# EAGLE design nexys2proto (EAGLE 5.06)
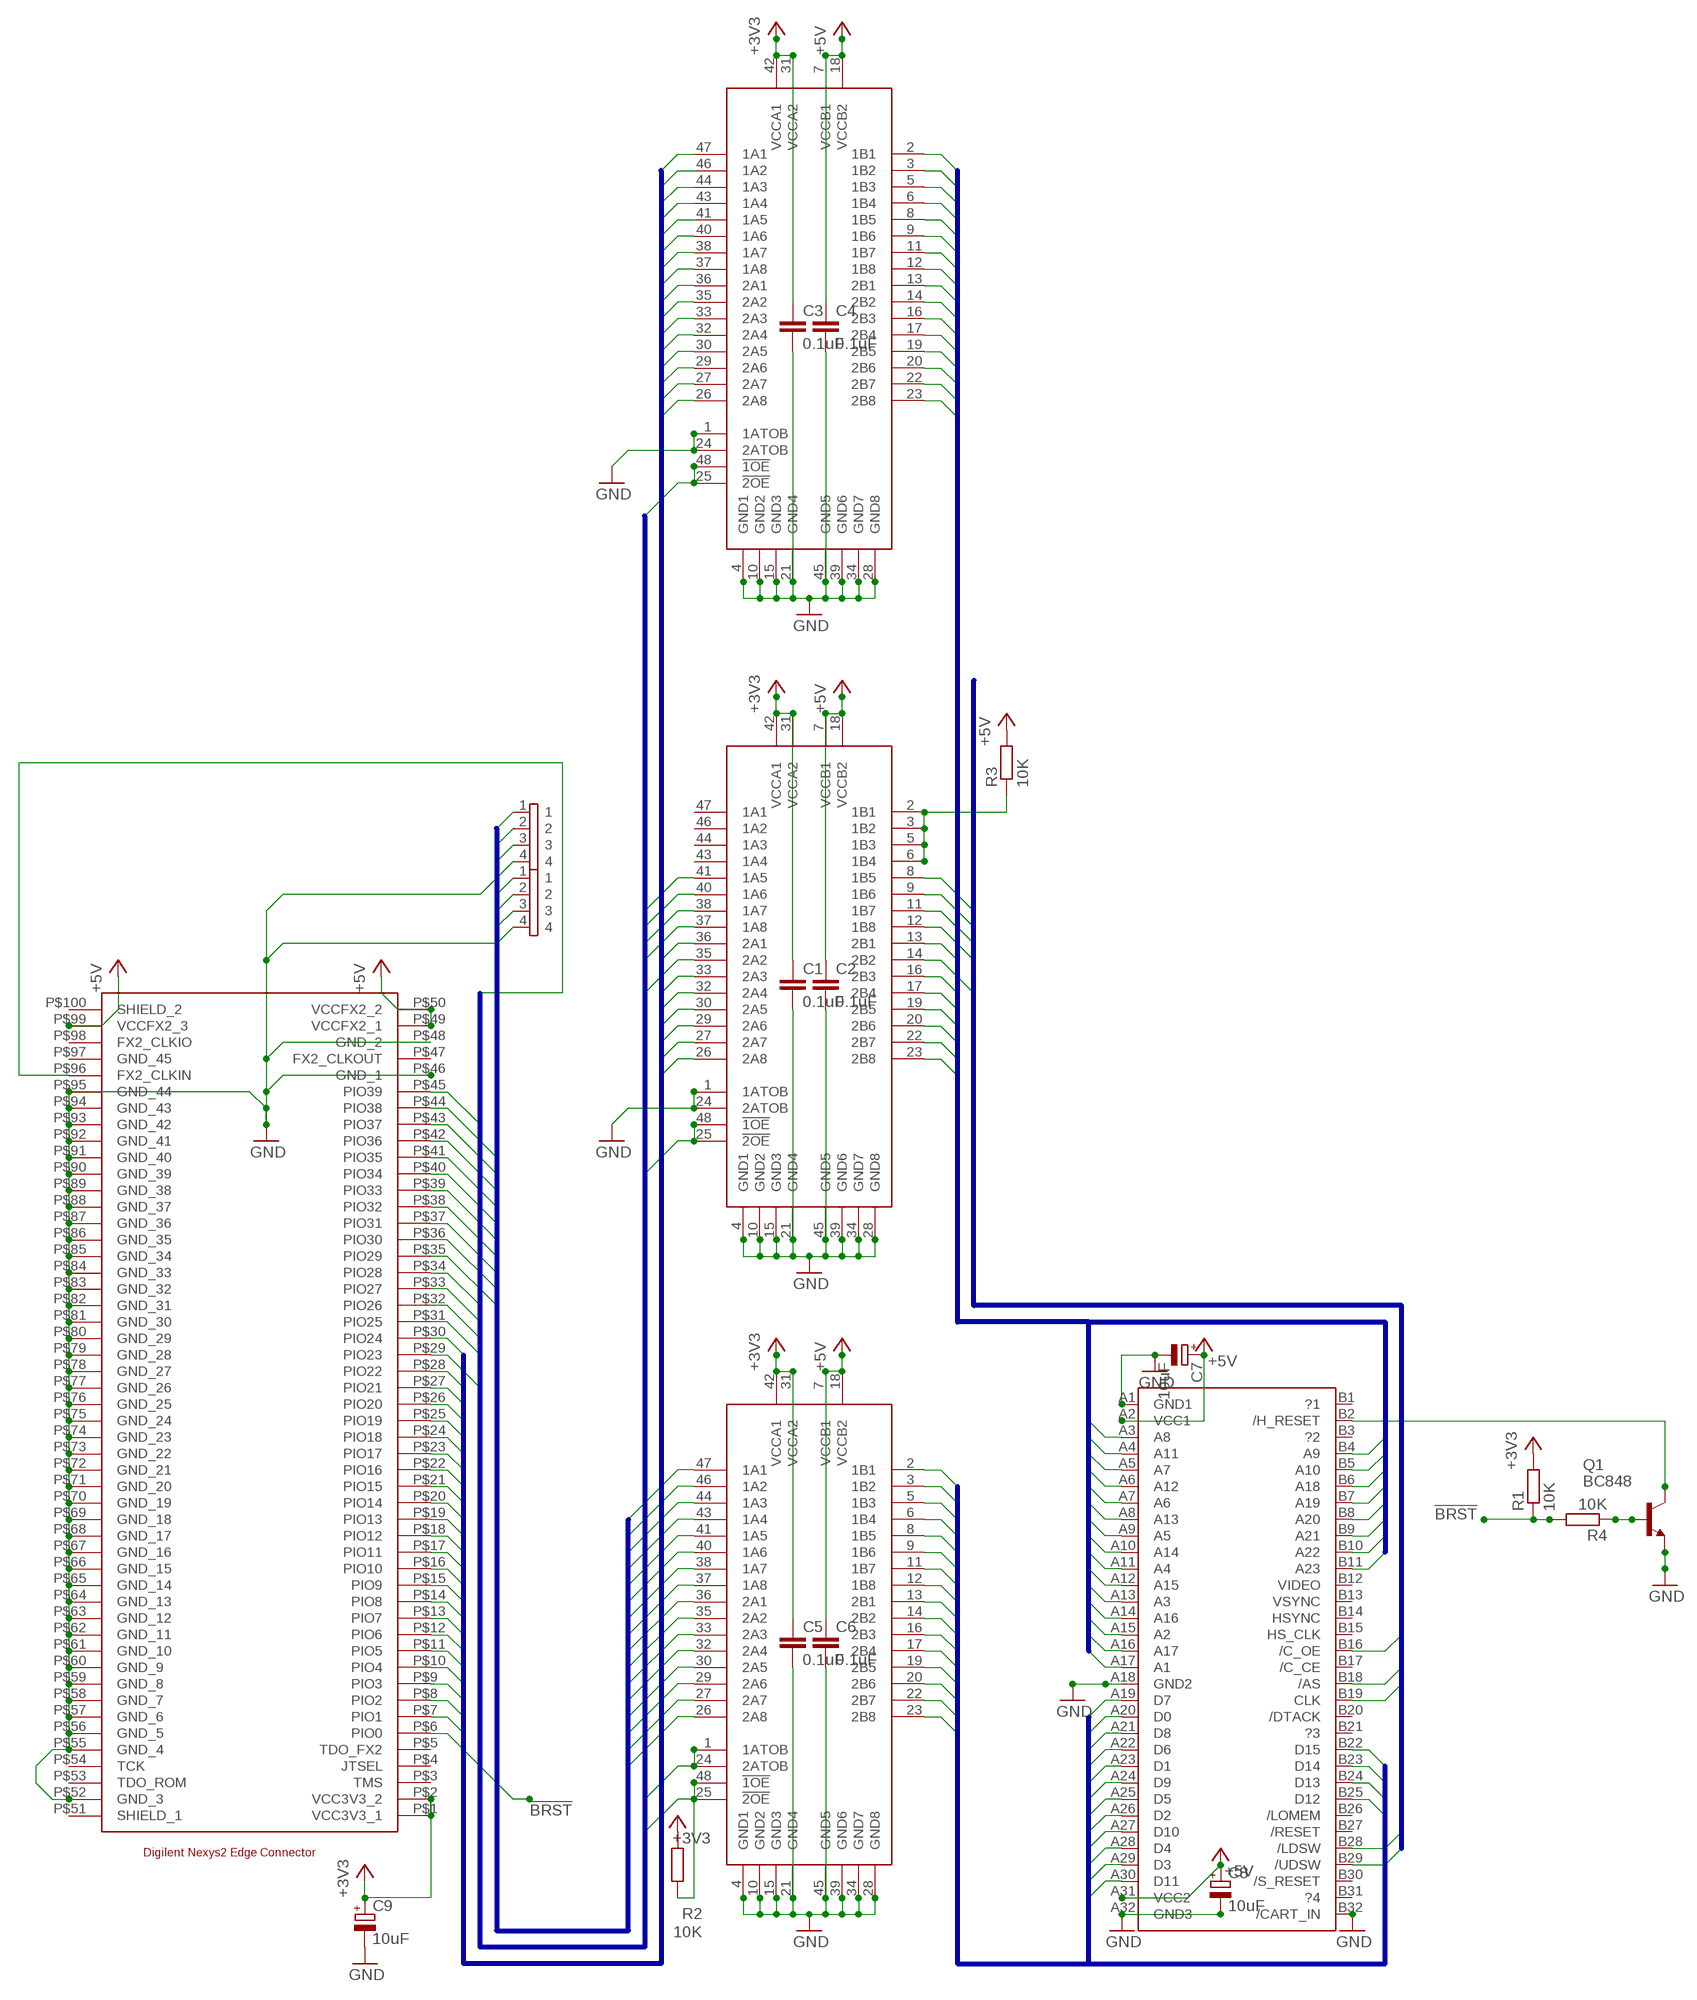
[diagram p0: schematic, sheet 1]

## Parts
C1  0.1uF  C-EUC0805  [C0805]
C2  0.1uF  C-EUC0805  [C0805]
C3  0.1uF  C-EUC0805  [C0805]
C4  0.1uF  C-EUC0805  [C0805]
C5  0.1uF  C-EUC0805  [C0805]
C6  0.1uF  C-EUC0805  [C0805]
C7  10uF  CPOL-EUCT3528  [CT3528]
C8  10uF  CPOL-EUCT3528  [CT3528]
C9  10uF  CPOL-EUCT3528  [CT3528]
CON1  MEGADRIVE_CART  [EDGE64]
IC1  SN74ALVC164245DGGR  [TSSOP48]
IC2  SN74ALVC164245DGGR  [TSSOP48]
IC3  SN74ALVC164245DGGR  [TSSOP48]
Q1  BC848  BC848BSMD  [SOT23]
R1  10K  R-EU_R0805  [R0805]
R2  10K  R-EU_R0805  [R0805]
R3  10K  R-EU_R0805  [R0805]
R4  10K  R-EU_R0805  [R0805]
U$1  DIGILENT_NEXYS2_J1  [HIROSE_FX2_100S_1.27SV(71)]
U$2  4P  [4P1S]
U$3  4P  [4P1S]

## Nets
!BMAS: IC2.37(1A8) U$1.P$31(PIO25)
!BMLDSW: IC2.38(1A7) U$1.P$32(PIO26)
!BMOE: IC2.35(2A2) U$1.P$29(PIO23)
!BMUDSW: IC2.40(1A6) U$1.P$33(PIO27)
!BRST: R1.1 R4.2 U$1.P$6(PIO0)
!BUFEN: IC1.25(!2OE) IC1.48(!1OE) IC2.25(!2OE) IC2.48(!1OE) IC3.25(!2OE) IC3.48(!1OE) R2.1 U$1.P$34(PIO28)
!MAS: CON1.B18(/AS) IC2.12(1B8)
!MLDSW: CON1.B28(/LDSW) IC2.11(1B7)
!MOE: CON1.B16(/C_OE) IC2.14(2B2)
!MUDSW: CON1.B29(/UDSW) IC2.9(1B6)
+3V3: C1.1 C3.1 C5.1 C9.+ IC1.31(VCCA2) IC1.42(VCCA1) IC2.31(VCCA2) IC2.42(VCCA1) IC3.31(VCCA2) IC3.42(VCCA1) R1.2 R2.2 U$1.P$1(VCC3V3_1) U$1.P$2(VCC3V3_2)
+5V: C2.1 C4.1 C6.1 C7.+ C8.+ CON1.A2(VCC1) CON1.A31(VCC2) IC1.7(VCCB1) IC1.18(VCCB2) IC2.7(VCCB1) IC2.18(VCCB2) IC3.7(VCCB1) IC3.18(VCCB2) R3.2 U$1.P$49(VCCFX2_1) U$1.P$50(VCCFX2_2) U$1.P$99(VCCFX2_3)
BMA1: IC2.36(2A1) U$1.P$30(PIO24)
BMA2: IC2.32(2A4) U$1.P$27(PIO21)
BMA3: IC2.29(2A6) U$1.P$25(PIO19)
BMA4: IC1.47(1A1) U$1.P$22(PIO16)
BMA5: IC1.41(1A5) U$1.P$18(PIO12)
BMA6: IC1.36(2A1) U$1.P$14(PIO8)
BMA7: IC1.30(2A5) U$1.P$10(PIO4)
BMA8: IC1.26(2A8) U$1.P$7(PIO1)
BMA9: IC1.29(2A6) U$1.P$9(PIO3)
BMA10: IC1.32(2A4) U$1.P$11(PIO5)
BMA11: IC1.27(2A7) U$1.P$8(PIO2)
BMA12: IC1.33(2A3) U$1.P$12(PIO6)
BMA13: IC1.38(1A7) U$1.P$16(PIO10)
BMA14: IC1.44(1A3) U$1.P$20(PIO14)
BMA15: IC2.27(2A7) U$1.P$24(PIO18)
BMA16: IC2.30(2A5) U$1.P$26(PIO20)
BMA17: IC2.33(2A3) U$1.P$28(PIO22)
BMA18: IC1.35(2A2) U$1.P$13(PIO7)
BMA19: IC1.37(1A8) U$1.P$15(PIO9)
BMA20: IC1.40(1A6) U$1.P$17(PIO11)
BMA21: IC1.43(1A4) U$1.P$19(PIO13)
BMA22: IC1.46(1A2) U$1.P$21(PIO15)
BMA23: IC2.26(2A8) U$1.P$23(PIO17)
BMCLK: IC2.41(1A5) U$1.P$96(FX2_CLKIN)
BMD0: IC3.27(2A7) U$1.P$36(PIO30)
BMD1: IC3.33(2A3) U$1.P$40(PIO34)
BMD2: IC3.41(1A5) U$2.1
BMD3: IC3.46(1A2) U$3.3
BMD4: IC3.44(1A3) U$2.2
BMD5: IC3.38(1A7) U$1.P$44(PIO38)
BMD6: IC3.30(2A5) U$1.P$38(PIO32)
BMD7: IC3.26(2A8) U$1.P$35(PIO29)
BMD8: IC3.29(2A6) U$1.P$37(PIO31)
BMD9: IC3.36(2A1) U$1.P$42(PIO36)
BMD10: IC3.43(1A4) U$3.2
BMD11: IC3.47(1A1) U$2.3
BMD12: IC3.40(1A6) U$3.1
BMD13: IC3.37(1A8) U$1.P$43(PIO37)
BMD14: IC3.35(2A2) U$1.P$41(PIO35)
BMD15: IC3.32(2A4) U$1.P$39(PIO33)
GND: C1.2 C2.2 C3.2 C4.2 C5.2 C6.2 C7.- C8.- C9.- CON1.A1(GND1) CON1.A18(GND2) CON1.A32(GND3) CON1.B32(/CART_IN) IC1.1(1ATOB) IC1.4(GND1) IC1.10(GND2) IC1.15(GND3) IC1.21(GND4) IC1.24(2ATOB) IC1.28(GND8) IC1.34(GND7) IC1.39(GND6) IC1.45(GND5) IC2.1(1ATOB) IC2.4(GND1) IC2.10(GND2) IC2.15(GND3) IC2.21(GND4) IC2.24(2ATOB) IC2.28(GND8) IC2.34(GND7) IC2.39(GND6) IC2.45(GND5) IC3.4(GND1) IC3.10(GND2) IC3.15(GND3) IC3.21(GND4) IC3.28(GND8) IC3.34(GND7) IC3.39(GND6) IC3.45(GND5) Q1.2(E) U$1.P$46(GND_1) U$1.P$48(GND_2) U$1.P$52(GND_3) U$1.P$55(GND_4) U$1.P$56(GND_5) U$1.P$57(GND_6) U$1.P$58(GND_7) U$1.P$59(GND_8) U$1.P$60(GND_9) U$1.P$61(GND_10) U$1.P$62(GND_11) U$1.P$63(GND_12) U$1.P$64(GND_13) U$1.P$65(GND_14) U$1.P$66(GND_15) U$1.P$67(GND_16) U$1.P$68(GND_17) U$1.P$69(GND_18) U$1.P$70(GND_19) U$1.P$71(GND_20) U$1.P$72(GND_21) U$1.P$73(GND_22) U$1.P$74(GND_23) U$1.P$75(GND_24) U$1.P$76(GND_25) U$1.P$77(GND_26) U$1.P$78(GND_27) U$1.P$79(GND_28) U$1.P$80(GND_29) U$1.P$81(GND_30) U$1.P$82(GND_31) U$1.P$83(GND_32) U$1.P$84(GND_33) U$1.P$85(GND_34) U$1.P$86(GND_35) U$1.P$87(GND_36) U$1.P$88(GND_37) U$1.P$89(GND_38) U$1.P$90(GND_39) U$1.P$91(GND_40) U$1.P$92(GND_41) U$1.P$93(GND_42) U$1.P$94(GND_43) U$1.P$95(GND_44) U$2.4 U$3.4
MA1: CON1.A17(A1) IC2.13(2B1)
MA2: CON1.A15(A2) IC2.17(2B4)
MA3: CON1.A13(A3) IC2.20(2B6)
MA4: CON1.A11(A4) IC1.2(1B1)
MA5: CON1.A9(A5) IC1.8(1B5)
MA6: CON1.A7(A6) IC1.13(2B1)
MA7: CON1.A5(A7) IC1.19(2B5)
MA8: CON1.A3(A8) IC1.23(2B8)
MA9: CON1.B4(A9) IC1.20(2B6)
MA10: CON1.B5(A10) IC1.17(2B4)
MA11: CON1.A4(A11) IC1.22(2B7)
MA12: CON1.A6(A12) IC1.16(2B3)
MA13: CON1.A8(A13) IC1.11(1B7)
MA14: CON1.A10(A14) IC1.5(1B3)
MA15: CON1.A12(A15) IC2.22(2B7)
MA16: CON1.A14(A16) IC2.19(2B5)
MA17: CON1.A16(A17) IC2.16(2B3)
MA18: CON1.B6(A18) IC1.14(2B2)
MA19: CON1.B7(A19) IC1.12(1B8)
MA20: CON1.B8(A20) IC1.9(1B6)
MA21: CON1.B9(A21) IC1.6(1B4)
MA22: CON1.B10(A22) IC1.3(1B2)
MA23: CON1.B11(A23) IC2.23(2B8)
MCLK: CON1.B19(CLK) IC2.8(1B5)
MD0: CON1.A20(D0) IC3.22(2B7)
MD1: CON1.A23(D1) IC3.16(2B3)
MD2: CON1.A26(D2) IC3.8(1B5)
MD3: CON1.A29(D3) IC3.3(1B2)
MD4: CON1.A28(D4) IC3.5(1B3)
MD5: CON1.A25(D5) IC3.11(1B7)
MD6: CON1.A22(D6) IC3.19(2B5)
MD7: CON1.A19(D7) IC3.23(2B8)
MD8: CON1.A21(D8) IC3.20(2B6)
MD9: CON1.A24(D9) IC3.13(2B1)
MD10: CON1.A27(D10) IC3.6(1B4)
MD11: CON1.A30(D11) IC3.2(1B1)
MD12: CON1.B25(D12) IC3.9(1B6)
MD13: CON1.B24(D13) IC3.12(1B8)
MD14: CON1.B23(D14) IC3.14(2B2)
MD15: CON1.B22(D15) IC3.17(2B4)
N$1: IC2.2(1B1) IC2.3(1B2) IC2.5(1B3) IC2.6(1B4) R3.1
N$2: CON1.B2(/H_RESET) Q1.3(C)
N$4: Q1.1(B) R4.1
R/!W: IC3.1(1ATOB) IC3.24(2ATOB) U$1.P$45(PIO39)
Unconnected: CON1.B1(?1) CON1.B3(?2) CON1.B12(VIDEO) CON1.B13(VSYNC) CON1.B14(HSYNC) CON1.B15(HS_CLK) CON1.B17(/C_CE) CON1.B20(/DTACK) CON1.B21(?3) CON1.B26(/LOMEM) CON1.B27(/RESET) CON1.B30(/S_RESET) CON1.B31(?4) IC2.43(1A4) IC2.44(1A3) IC2.46(1A2) IC2.47(1A1) U$1.P$3(TMS) U$1.P$4(JTSEL) U$1.P$5(TDO_FX2) U$1.P$47(FX2_CLKOUT) U$1.P$51(SHIELD_1) U$1.P$53(TDO_ROM) U$1.P$54(TCK) U$1.P$97(GND_45) U$1.P$98(FX2_CLKIO) U$1.P$100(SHIELD_2)

## Buses
MD[0..15]
MA[1..23]
MCLK,!MOE,!MAS,!MLDSW,!MUDSW
BMCLK,!BMOE,!BMAS,!BMLDSW,!BMUDSW,!BUFEN,R/!W
BMA[1..23]
BMD[0..15]

## Library data of the parts
C1-C6 = rcl:C-EU: CAPACITOR, European symbol
C7-C9 = rcl:CPOL-EU: POLARIZED CAPACITOR, European symbol
CON1 = chris:MEGADRIVE_CART
IC1-IC3 = mypac:SN74ALVC164245
Q1 = transistor-npn:BC848*: NPN Transistor
R1-R4 = rcl:R-EU_: RESISTOR, European symbol
U$1 = chris:DIGILENT_NEXYS2_J1
U$2 U$3 = chris:4P

## Board
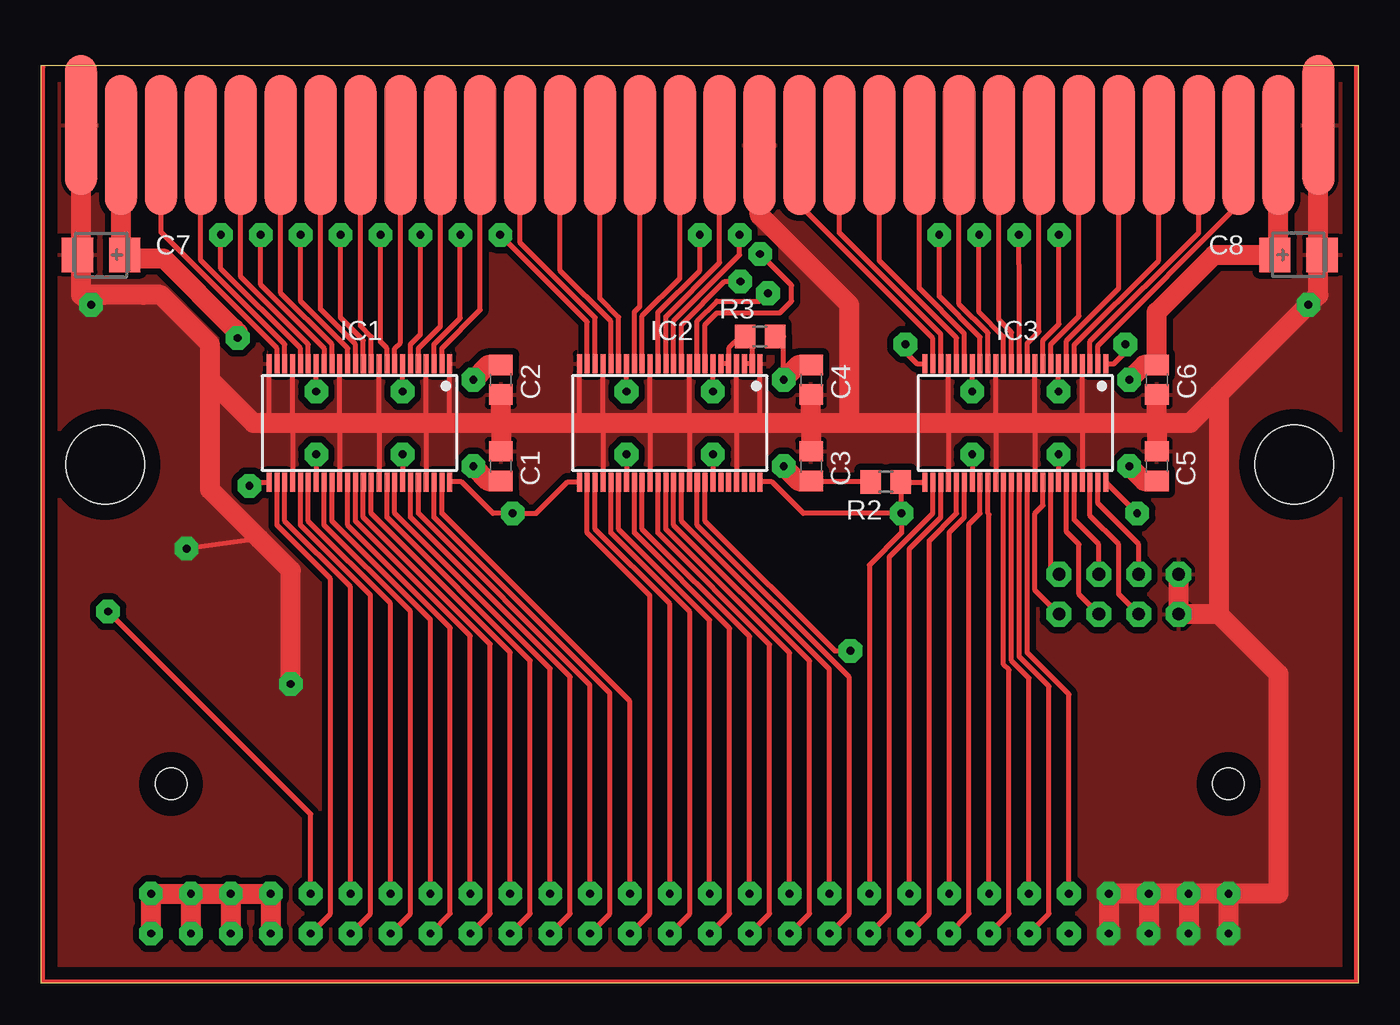
[diagram p1: board, top side]
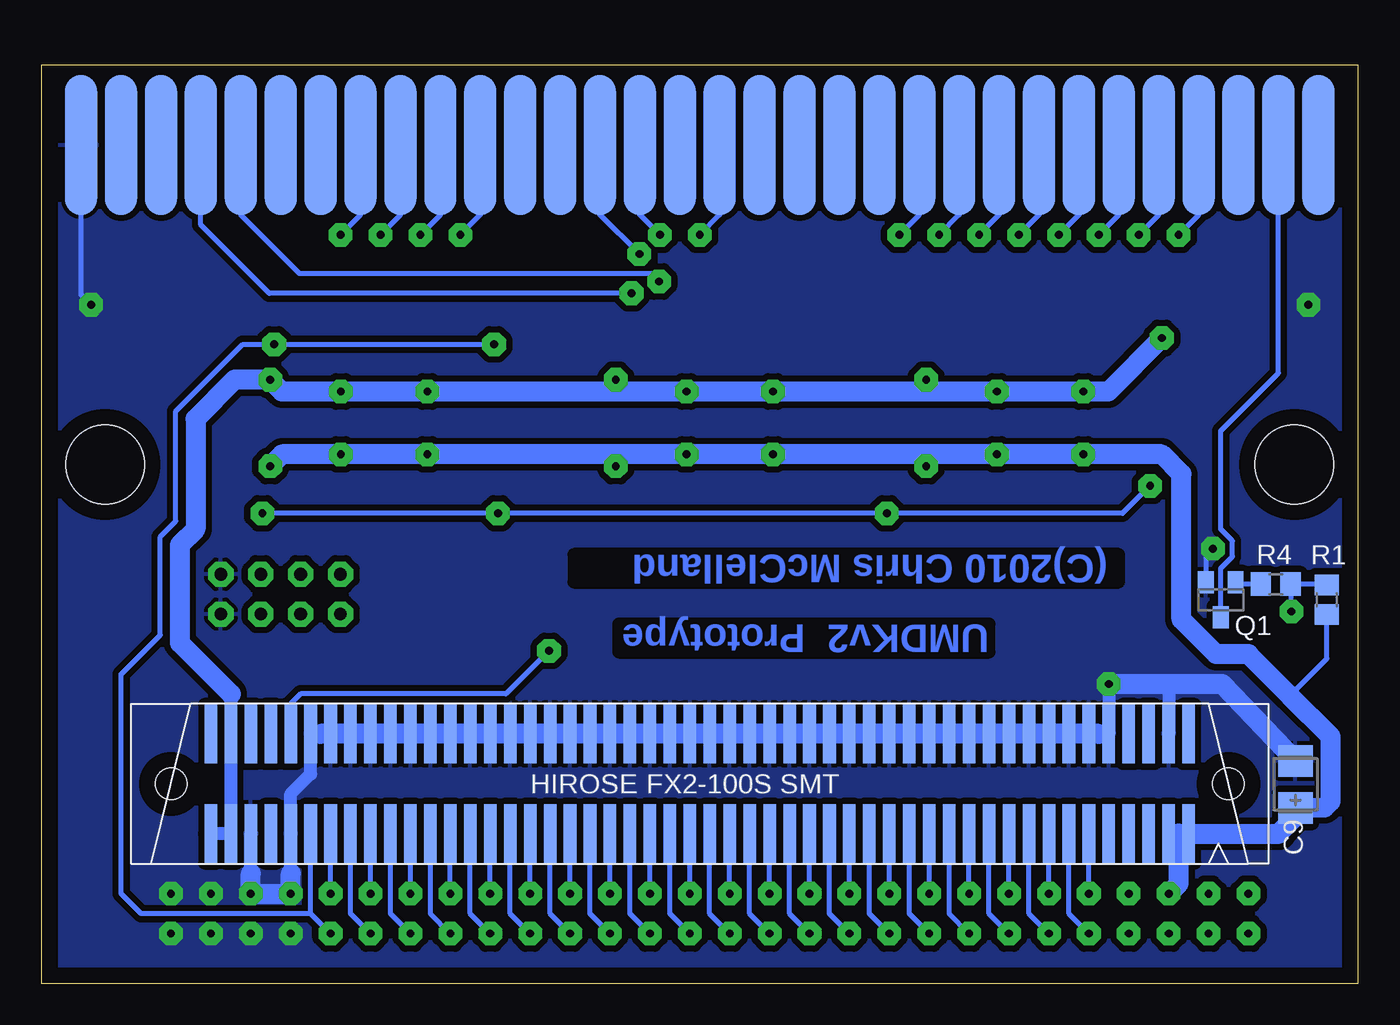
[diagram p2: board, bottom side, seen from below]

Size 83.82 x 58.42 mm. Coordinates in mm from the lower left corner, seen from the top.
Outline: 83.82,0 0,0 0,58.42 83.82,58.42 83.82,0
Copper layers (1*16): Top 0.035mm / dielectric 1.5mm / Bottom 0.035mm
Design rules "default *": minimum track width 10mil, minimum drill 0.5mm, track to track 7mil, track to pad 7mil, pad to pad 7mil, via to via 7mil, smd to smd 7mil, copper to edge 40mil, drill to drill 8mil, minimum pad ring 10mil, minimum via ring 8mil, stop-mask expansion 4mil, vias tented up to drill 0mil, thermal gap 10mil
Holes 5 mm at 79.76,33.02 4.06,33.02

### Footprints (pad centres in the part's own frame; a part is rotated, then mirrored left to right if it is on the bottom)
C0805 = smd 1.3 x 1.5: 1 -0.95,0; 2 0.95,0
CT3528 = smd 2 x 2.2: + -1.5,0; - 1.5,0
EDGE64 = smd 8.89 x 2.032 bottom: A1 1.905,0; A2 3.175,-2.54; A3 3.175,-5.08; A4 3.175,-7.62; A5 3.175,-10.16; A6 3.175,-12.7; A7 3.175,-15.24; A8 3.175,-17.78; A9 3.175,-20.32; A10 3.175,-22.86; A11 3.175,-25.4; A12 3.175,-27.94; A13 3.175,-30.48; A14 3.175,-33.02; A15 3.175,-35.56; A16 3.175,-38.1; A17 3.175,-40.64; A18 3.175,-43.18; A19 3.175,-45.72; A20 3.175,-48.26; A21 3.175,-50.8; A22 3.175,-53.34; A23 3.175,-55.88; A24 3.175,-58.42; A25 3.175,-60.96; A26 3.175,-63.5; A27 3.175,-66.04; A28 3.175,-68.58; A29 3.175,-71.12; A30 3.175,-73.66; A31 3.175,-76.2; A32 1.905,-78.74 | smd 8.89 x 2.032: B1 3.175,0; B2 3.175,-2.54; B3 3.175,-5.08; B4 3.175,-7.62; B5 3.175,-10.16; B6 3.175,-12.7; B7 3.175,-15.24; B8 3.175,-17.78; B9 3.175,-20.32; B10 3.175,-22.86; B11 3.175,-25.4; B12 3.175,-27.94; B13 3.175,-30.48; B14 3.175,-33.02; B15 3.175,-35.56; B16 3.175,-38.1; B17 3.175,-40.64; B18 3.175,-43.18; B19 3.175,-45.72; B20 3.175,-48.26; B21 3.175,-50.8; B22 3.175,-53.34; B23 3.175,-55.88; B24 3.175,-58.42; B25 3.175,-60.96; B26 3.175,-63.5; B27 3.175,-66.04; B28 3.175,-68.58; B29 3.175,-71.12; B30 3.175,-73.66; B31 3.175,-76.2; B32 3.175,-78.74
TSSOP48 = smd 0.32 x 1.2: 1 0,0.475; 2 0.5,0.475; 3 1,0.475; 4 1.5,0.475; 5 2,0.475; 6 2.5,0.475; 7 3,0.475; 8 3.5,0.475; 9 4,0.475; 10 4.5,0.475; 11 5,0.475; 12 5.5,0.475; 13 6,0.475; 14 6.5,0.475; 15 7,0.475; 16 7.5,0.475; 17 8,0.475; 18 8.5,0.475; 19 9,0.475; 20 9.5,0.475; 21 10,0.475; 22 10.5,0.475; 23 11,0.475; 24 11.5,0.475; 25 11.5,8.025; 26 11,8.025; 27 10.5,8.025; 28 10,8.025; 29 9.5,8.025; 30 9,8.025; 31 8.5,8.025; 32 8,8.025; 33 7.5,8.025; 34 7,8.025; 35 6.5,8.025; 36 6,8.025; 37 5.5,8.025; 38 5,8.025; 39 4.5,8.025; 40 4,8.025; 41 3.5,8.025; 42 3,8.025; 43 2.5,8.025; 44 2,8.025; 45 1.5,8.025; 46 1,8.025; 47 0.5,8.025; 48 0,8.025
SOT23 = smd 1 x 1.4: 1 -0.95,-1.1; 2 0.95,-1.1; 3 0,1.1
R0805 = smd 1.3 x 1.5: 1 -0.95,0; 2 0.95,0
HIROSE_FX2_100S_1.27SV(71) = smd 0.8 x 3.75: P$1 2.54,3.175; P$2 3.81,3.175; P$3 5.08,3.175; P$4 6.35,3.175; P$5 7.62,3.175; P$6 8.89,3.175; P$7 10.16,3.175; P$8 11.43,3.175; P$9 12.7,3.175; P$10 13.97,3.175; P$11 15.24,3.175; P$12 16.51,3.175; P$13 17.78,3.175; P$14 19.05,3.175; P$15 20.32,3.175; P$16 21.59,3.175; P$17 22.86,3.175; P$18 24.13,3.175; P$19 25.4,3.175; P$20 26.67,3.175; P$21 27.94,3.175; P$22 29.21,3.175; P$23 30.48,3.175; P$24 31.75,3.175; P$25 33.02,3.175; P$26 34.29,3.175; P$27 35.56,3.175; P$28 36.83,3.175; P$29 38.1,3.175; P$30 39.37,3.175; P$31 40.64,3.175; P$32 41.91,3.175; P$33 43.18,3.175; P$34 44.45,3.175; P$35 45.72,3.175; P$36 46.99,3.175; P$37 48.26,3.175; P$38 49.53,3.175; P$39 50.8,3.175; P$40 52.07,3.175; P$41 53.34,3.175; P$42 54.61,3.175; P$43 55.88,3.175; P$44 57.15,3.175; P$45 58.42,3.175; P$46 59.69,3.175; P$47 60.96,3.175; P$48 62.23,3.175; P$49 63.5,3.175; P$50 64.77,3.175; P$51 2.54,-3.175; P$52 3.81,-3.175; P$53 5.08,-3.175; P$54 6.35,-3.175; P$55 7.62,-3.175; P$56 8.89,-3.175; P$57 10.16,-3.175; P$58 11.43,-3.175; P$59 12.7,-3.175; P$60 13.97,-3.175; P$61 15.24,-3.175; P$62 16.51,-3.175; P$63 17.78,-3.175; P$64 19.05,-3.175; P$65 20.32,-3.175; P$66 21.59,-3.175; P$67 22.86,-3.175; P$68 24.13,-3.175; P$69 25.4,-3.175; P$70 26.67,-3.175; P$71 27.94,-3.175; P$72 29.21,-3.175; P$73 30.48,-3.175; P$74 31.75,-3.175; P$75 33.02,-3.175; P$76 34.29,-3.175; P$77 35.56,-3.175; P$78 36.83,-3.175; P$79 38.1,-3.175; P$80 39.37,-3.175; P$81 40.64,-3.175; P$82 41.91,-3.175; P$83 43.18,-3.175; P$84 44.45,-3.175; P$85 45.72,-3.175; P$86 46.99,-3.175; P$87 48.26,-3.175; P$88 49.53,-3.175; P$89 50.8,-3.175; P$90 52.07,-3.175; P$91 53.34,-3.175; P$92 54.61,-3.175; P$93 55.88,-3.175; P$94 57.15,-3.175; P$95 58.42,-3.175; P$96 59.69,-3.175; P$97 60.96,-3.175; P$98 62.23,-3.175; P$99 63.5,-3.175; P$100 64.77,-3.175 | hole 2: 67.31,0; 0,0
4P1S = drill 0.8 pad 1.6 octagon: 1 0,3.81; 2 0,1.27; 3 0,-1.27; 4 0,-3.81

### Placement (x,y rotation side)
C1  29.25,32.91 90 top
C2  29.25,38.41 270 top
C3  49,32.91 90 top
C4  49,38.41 270 top
C5  71,32.91 90 top
C6  71,38.41 270 top
C7  3.81,46.35 180 top
C8  80.01,46.35 0 top
C9  4,12.66 90 bottom
CON1  2.54,56.52 270 bottom
IC1  26,39.91 180 top
IC2  45.75,39.91 180 top
IC3  67.75,39.91 180 top
Q1  8.75,24.41 180 bottom
R1  2,24.41 270 bottom
R2  53.75,31.91 180 top
R3  45.75,41.16 0 top
R4  5.25,25.41 0 bottom
U$1  8.26,12.7 180 bottom
U$2  68.58,26.04 90 top
U$3  68.58,23.5 90 top

### Tracks (layer width: path | path; a pad name or v marks a point on that pad's centre or on a via)
!BMAS  (via drill 0.5 pad 1.5)
  Top 0.305: v47.62,3.18 48.9,4.45 48.9,20.51 40.25,29.16 IC2.37
  Bottom 0.305: U$1.P$31 48.9,4.45 v47.62,3.18
!BMLDSW  (via drill 0.5 pad 1.5)
  Top 0.305: IC2.38 40.75,29.41 50.16,20 v50.16,5.71
  Bottom 0.305: v50.16,5.71 U$1.P$32
!BMOE  (via drill 0.5 pad 1.5)
  Top 0.305: v45.09,3.18 46.35,4.45 46.35,21.56 39.25,28.66 IC2.35
  Bottom 0.305: U$1.P$29 46.35,4.45 v45.09,3.18
!BMUDSW  (via drill 0.5 pad 1.5)
  Top 0.305: v50.16,3.18 51.44,4.45 51.44,19.47 41.75,29.16 IC2.40
  Bottom 0.305: U$1.P$33 51.44,4.45 v50.16,3.18
!BRST  (via drill 0.5 pad 1.5)
  Top 0.305: v17.14,5.71 17.14,10.76 v4.25,23.66
  Bottom 0.305: v17.14,5.71 U$1.P$6 | R1.1 2.08,25.44 4.02,25.44 R4.2 4.25,25.21 v4.25,23.66
!BUFEN  (via drill 0.5 pad 1.5)
  Top 0.305: IC3.25 54.73,31.89 R2.1 54.75,31.91 v54.75,29.91 | v69.75,29.91 69.72,29.91 IC3.48 | v54.75,29.91 54.75,28.66 52.7,26.61 v52.7,5.71 | v54.75,29.91 48.5,29.91 46.5,31.91 45.77,31.91 IC2.48 | IC2.25 34.23,31.91 33.5,31.91 31.5,29.91 v30,29.91 28.75,29.91 26.75,31.91 26.02,31.91 IC1.48 | v13.25,31.66 13.47,31.89 IC1.25
  Bottom 0.305: v69.75,29.91 v54.75,29.91 v30,29.91 15,29.91 v13.25,31.66 | v52.7,5.71 U$1.P$34
!MAS  (via drill 0.5 pad 1.5)
  Top 0.305: v44.45,47.62 44.45,46.35 40.25,42.16 IC2.12
  Bottom 0.305: v44.45,47.62 45.72,48.89 CON1.B18
!MLDSW  (via drill 0.5 pad 1.5)
  Top 0.305: v44.5,44.66 43.5,44.66 40.75,41.91 IC2.11
  Bottom 0.305: CON1.B28 71.12,48.89 67.39,45.16 66.67,45.16 | v44.5,44.66 45,45.16 66.67,45.16 | 66.67,45.16 66.75,45.16
!MOE  (via drill 0.5 pad 1.5)
  Top 0.305: v41.91,47.62 41.91,45.35 39.25,42.69 IC2.14
  Bottom 0.305: v41.91,47.62 40.64,48.89 CON1.B16
!MUDSW  (via drill 0.5 pad 1.5)
  Top 0.305: v46.25,43.91 45.75,43.41 43,43.41 41.75,42.16 IC2.9
  Bottom 0.305: CON1.B29 73.66,48.26 69.31,43.91 v46.25,43.91
+3V3  (via drill 0.5 pad 1.5)
  Top 0.305: v59.25,33.66 IC3.31 | v64.75,33.66 IC3.42 | v42.75,33.66 IC2.42 | v37.25,33.66 IC2.31 | v23,33.66 IC1.42 | v17.5,33.66 IC1.31 | C3.1 52.75,31.96 R2.2
  Top 1.27: C1.1 28.45,31.96 v27.5,32.91 | C3.1 48.2,31.96 v47.25,32.91 | C5.1 70.2,31.96 v69.25,32.91 | v12.06,5.71 v14.61,5.71 v14.61,3.18 | v12.06,5.71 v12.06,3.18 | v9.53,5.71 v12.06,5.71 | v9.53,5.71 v6.99,5.71 v6.99,3.18 | v9.53,5.71 v9.53,3.18
  Bottom 0.305: v37.25,33.66 v42.75,33.66 | 27.5,33.66 v27.5,32.91 | 47.25,33.66 v47.25,32.91 | 11.43,9.52 U$1.P$2 | R1.2 2,20.66 4.34,18.32
  Bottom 1.27: v69.25,32.91 68.5,33.66 v64.75,33.66 v59.25,33.66 47.25,33.66 v42.75,33.66 v37.25,33.66 27.5,33.66 v23,33.66 v17.5,33.66 12.5,33.66 11.25,32.41 11.25,23.16 9.04,20.96 6.99,20.96 4.34,18.32 1.75,15.72 1.75,11.58 2.13,11.2 C9.+ 3.81,10.79 5,9.61 5,9.52 U$1.P$1 11.43,9.52 11.43,6.35 v12.06,5.71
+5V  (via drill 0.5 pad 1.5)
  Top 0.305: v64.75,37.66 IC3.7 | v59.25,37.66 IC3.18 | v17.5,37.66 IC1.18 | v23,37.66 IC1.7 | v42.75,37.66 IC2.7 | v37.25,37.66 IC2.18 | C7.+ 5.08,46.58 | R3.2 47.25,41.16 v47.25,38.41
  Top 1.27: C2.1 28.45,39.36 v27.5,38.41 | C4.1 48.2,39.36 v47.25,38.41 | v69.25,38.41 70.2,39.36 C6.1 71,42.71 74.64,46.35 C8.+ 78.74,46.58 78.33,46.58 78.74,46.99 CON1.A31 | 5.08,46.58 CON1.A2 | C7.+ 5.31,46.12 7.79,46.12 12.25,41.66 | 12.25,41.66 12.31,41.6 | 12.25,41.66 12.5,41.41 v12.5,41.06
  Bottom 0.305: v17.5,37.66 v23,37.66 | v37.25,37.66 v42.75,37.66 | 27.5,37.66 v27.5,38.41 | 47.25,37.66 v47.25,38.41
  Bottom 0.813: U$1.P$50 U$1.P$49 U$1.P$99 71.75,18.42
  Bottom 1.27: 71.75,18.42 75,21.66 75,27.91 74,28.91 74,35.91 71.5,38.41 v69.25,38.41 68.5,37.66 v64.75,37.66 v59.25,37.66 47.25,37.66 v42.75,37.66 v37.25,37.66 27.5,37.66 v23,37.66 v17.5,37.66 15.9,37.66 v12.5,41.06
BMA1  (via drill 0.5 pad 1.5)
  Top 0.305: IC2.36 39.75,28.91 47.62,21.04 v47.62,5.71
  Bottom 0.305: v47.62,5.71 U$1.P$30
BMA2  (via drill 0.5 pad 1.5)
  Top 0.305: v42.55,3.18 43.81,4.45 43.81,22.6 37.75,28.66 IC2.32
  Bottom 0.305: U$1.P$27 43.81,4.45 v42.55,3.18
BMA3  (via drill 0.5 pad 1.5)
  Top 0.305: v40.01,3.18 41.27,4.45 41.27,23.64 36.25,28.66 IC2.29
  Bottom 0.305: U$1.P$25 41.27,4.45 v40.01,3.18
BMA4  (via drill 0.5 pad 1.5)
  Top 0.305: IC1.47 25.5,29.91 37.47,17.94 v37.47,5.71
  Bottom 0.305: v37.47,5.71 U$1.P$22
BMA5  (via drill 0.5 pad 1.5)
  Top 0.305: IC1.41 22.5,29.91 32.38,20.03 v32.38,5.71
  Bottom 0.305: v32.38,5.71 U$1.P$18
BMA6  (via drill 0.5 pad 1.5)
  Top 0.305: IC1.36 20,29.41 27.3,22.11 v27.3,5.71
  Bottom 0.305: v27.3,5.71 U$1.P$14
BMA7  (via drill 0.5 pad 1.5)
  Top 0.305: IC1.30 17,29.41 22.23,24.18 v22.23,5.71
  Bottom 0.305: v22.23,5.71 U$1.P$10
BMA8  (via drill 0.5 pad 1.5)
  Top 0.305: IC1.26 15,29.16 18.41,25.75 18.41,4.45 v17.14,3.18
  Bottom 0.305: U$1.P$7 18.41,4.45 v17.14,3.18
BMA9  (via drill 0.5 pad 1.5)
  Top 0.305: IC1.29 16.5,29.16 20.95,24.71 20.95,4.45 v19.68,3.18
  Bottom 0.305: U$1.P$9 20.95,4.45 v19.68,3.18
BMA10  (via drill 0.5 pad 1.5)
  Top 0.305: IC1.32 18,29.16 23.5,23.67 23.5,4.45 v22.23,3.18
  Bottom 0.305: U$1.P$11 23.5,4.45 v22.23,3.18
BMA11  (via drill 0.5 pad 1.5)
  Top 0.305: IC1.27 15.5,29.41 19.68,25.22 v19.68,5.71
  Bottom 0.305: v19.68,5.71 U$1.P$8
BMA12  (via drill 0.5 pad 1.5)
  Top 0.305: IC1.33 18.5,29.41 24.77,23.14 v24.77,5.71
  Bottom 0.305: v24.77,5.71 U$1.P$12
BMA13  (via drill 0.5 pad 1.5)
  Top 0.305: IC1.38 21,29.91 29.84,21.07 v29.84,5.71
  Bottom 0.305: v29.84,5.71 U$1.P$16
BMA14  (via drill 0.5 pad 1.5)
  Top 0.305: IC1.44 24,29.91 34.92,18.99 v34.92,5.71
  Bottom 0.305: v34.92,5.71 U$1.P$20
BMA15  (via drill 0.5 pad 1.5)
  Top 0.305: IC2.27 35.25,28.91 40.01,24.15 v40.01,5.71
  Bottom 0.305: v40.01,5.71 U$1.P$24
BMA16  (via drill 0.5 pad 1.5)
  Top 0.305: IC2.30 36.75,28.91 42.55,23.11 v42.55,5.71
  Bottom 0.305: v42.55,5.71 U$1.P$26
BMA17  (via drill 0.5 pad 1.5)
  Top 0.305: IC2.33 38.25,28.91 45.09,22.07 v45.09,5.71
  Bottom 0.305: v45.09,5.71 U$1.P$28
BMA18  (via drill 0.5 pad 1.5)
  Top 0.305: IC1.35 19.5,29.16 26.04,22.63 26.04,4.45 v24.77,3.18
  Bottom 0.305: U$1.P$13 26.04,4.45 v24.77,3.18
BMA19  (via drill 0.5 pad 1.5)
  Top 0.305: IC1.37 20.5,29.66 28.57,21.58 28.57,4.45 v27.3,3.18
  Bottom 0.305: U$1.P$15 28.57,4.45 v27.3,3.18
BMA20  (via drill 0.5 pad 1.5)
  Top 0.305: IC1.40 22,29.66 31.11,20.54 31.11,4.45 v29.84,3.18
  Bottom 0.305: U$1.P$17 31.11,4.45 v29.84,3.18
BMA21  (via drill 0.5 pad 1.5)
  Top 0.305: IC1.43 23.5,29.66 33.66,19.5 33.66,4.45 v32.38,3.18
  Bottom 0.305: U$1.P$19 33.66,4.45 v32.38,3.18
BMA22  (via drill 0.5 pad 1.5)
  Top 0.305: IC1.46 25,29.66 36.2,18.46 36.2,4.45 v34.92,3.18
  Bottom 0.305: U$1.P$21 36.2,4.45 v34.92,3.18
BMA23  (via drill 0.5 pad 1.5)
  Top 0.305: v37.47,3.18 38.73,4.45 38.73,24.68 34.75,28.66 IC2.26
  Bottom 0.305: U$1.P$23 38.73,4.45 v37.47,3.18
BMCLK  (via drill 0.5 pad 1.5)
  Top 0.305: IC2.41 42.25,29.41 50.5,21.16 v51.5,21.16
  Bottom 0.305: U$1.P$96 67.94,17.78 67.31,18.42 54.24,18.42 v51.5,21.16
BMD0  (via drill 0.5 pad 1.5)
  Top 0.305: IC3.27 57.25,29.66 55.24,27.65 v55.24,5.71
  Bottom 0.305: v55.24,5.71 U$1.P$36
BMD1  (via drill 0.5 pad 1.5)
  Top 0.305: IC3.33 60.25,29.91 60.33,29.83 v60.33,5.71
  Bottom 0.305: v60.33,5.71 U$1.P$40
BMD2
  Top 0.305: IC3.41 64.25,26.56 U$2.1
BMD3
  Top 0.305: IC3.46 66.75,29.77 68.58,27.94 68.58,24.76 U$3.3
BMD4
  Top 0.305: IC3.44 65.75,29.5 67.31,27.94 U$2.2
BMD5  (via drill 0.5 pad 1.5)
  Top 0.305: IC3.38 62.75,21.04 65.41,18.39 v65.41,5.71
  Bottom 0.305: v65.41,5.71 U$1.P$44
BMD6  (via drill 0.5 pad 1.5)
  Top 0.305: IC3.30 58.75,29.66 57.78,28.69 v57.78,5.71
  Bottom 0.305: v57.78,5.71 U$1.P$38
BMD7  (via drill 0.5 pad 1.5)
  Top 0.305: v52.7,3.18 53.98,4.45 53.98,27.14 56.75,29.91 IC3.26
  Bottom 0.305: U$1.P$35 53.98,4.45 v52.7,3.18
BMD8  (via drill 0.5 pad 1.5)
  Top 0.305: v55.24,3.18 56.52,4.45 56.52,28.18 58.25,29.91 IC3.29
  Bottom 0.305: U$1.P$37 56.52,4.45 v55.24,3.18
BMD9  (via drill 0.5 pad 1.5)
  Top 0.305: IC3.36 61.75,20.54 62.87,19.43 v62.87,5.71
  Bottom 0.305: v62.87,5.71 U$1.P$42
BMD10
  Top 0.305: IC3.43 65.25,28.73 66.04,27.94 66.04,24.76 U$3.2
BMD11
  Top 0.305: IC3.47 67.25,30.54 69.85,27.94 U$2.3
BMD12
  Top 0.305: IC3.40 63.75,30.41 63.25,29.91 63.25,25.01 U$3.1
BMD13  (via drill 0.5 pad 1.5)
  Top 0.305: v62.87,3.18 64.14,4.45 64.14,18.9 62.25,20.79 IC3.37
  Bottom 0.305: U$1.P$43 64.14,4.45 v62.87,3.18
BMD14  (via drill 0.5 pad 1.5)
  Top 0.305: v60.33,3.18 61.59,4.45 61.59,19.94 61.25,20.29 IC3.35
  Bottom 0.305: U$1.P$41 61.59,4.45 v60.33,3.18
BMD15  (via drill 0.5 pad 1.5)
  Top 0.305: v57.78,3.18 59.05,4.45 59.05,29.21 59.75,29.91 IC3.32
  Bottom 0.305: U$1.P$39 59.05,4.45 v57.78,3.18
GND  (via drill 0.5 pad 1.5)
  Top 0.305: IC3.45 66.25,35.66 IC3.4 | IC3.28 57.75,35.66 IC3.21 | IC3.10 63.25,35.66 IC3.39 | IC3.15 60.75,35.66 IC3.34 | IC1.21 16,35.66 IC1.28 | IC1.4 24.5,35.66 IC1.45 | IC1.39 21.5,35.66 IC1.10 | IC1.34 19,35.66 IC1.15 | IC2.39 41.25,35.66 IC2.10 | IC2.21 35.75,35.66 IC2.28 | IC2.34 38.75,35.66 IC2.15 | 2.54,46.58 C7.- | IC2.4 44.25,35.66 IC2.45 | 34,35.66 34.25,35.41 | 26.25,35.66 26,35.91 IC1.1 | 6.5,43.81 6.62,43.81 | 14.5,35.66 IC1.24 | IC2.24 34.25,35.7 34.29,35.66 | IC2.1 45.75,35.69 45.72,35.66 | 4,43.81 4.35,43.72 | 13.88,28.29 v9.25,27.66
  Top 1.27: 49,35.66 45.72,35.66 44.25,35.66 41.25,35.66 38.75,35.66 35.75,35.66 34.29,35.66 34,35.66 29.25,35.66 | 49,35.66 51.44,35.66 | 51.44,35.66 57.75,35.66 60.75,35.66 63.25,35.66 66.25,35.66 71,35.66 | 29.25,35.66 26.25,35.66 24.5,35.66 21.5,35.66 19,35.66 16,35.66 14.5,35.66 13.5,35.66 10.75,38.41 | 29.25,35.66 C2.2 | 29.25,35.66 C1.2 | 49,35.66 C4.2 | 49,35.66 C3.2 | 71,35.66 C6.2 | 71,35.66 C5.2 | CON1.A1 2.54,46.58 2.54,43.81 | 81.28,46.58 CON1.A32 | 81.28,46.58 C8.- | 81.28,46.58 81.28,43.81 v80.64,43.18 74.93,37.47 | 74.93,37.47 73.12,35.66 71,35.66 | CON1.A18 45.72,48.89 51.44,43.18 51.44,35.66 | 10.75,38.41 10.75,40.66 7.59,43.81 6.5,43.81 4,43.81 2.54,43.81 | v70.48,5.71 v67.94,5.71 v67.94,3.18 | v73.03,5.71 v70.48,5.71 | v75.56,5.71 v73.03,5.71 | v75.56,5.71 78.74,5.71 78.74,19.69 74.93,23.5 | v70.48,5.71 v70.48,3.18 | v73.03,5.71 v73.03,3.18 | v75.56,5.71 v75.56,3.18 | 74.93,23.5 74.93,37.46 74.93,37.47 | 74.93,23.5 U$3.4 U$2.4 | v15.88,19.05 15.88,26.29 13.88,28.29 10.75,31.41 10.75,38.41 | 2.54,43.81 v3.17,43.18
  Bottom 0.305: CON1.B32 81.28,43.81 v80.64,43.18 | 9.5,27.41 v9.25,27.66 9.7,27.21 Q1.2
  Bottom 0.813: 12.06,19.05 U$1.P$52 | v15.88,19.05 U$1.P$55 16.51,15.88 | 66.04,15.88 U$1.P$95 66.67,13.33 67.94,12.07 U$1.P$46 67.94,6.98 | 70.48,6.98 U$1.P$48
  Bottom 1.27: v15.88,19.05 12.06,19.05 8.66,19.05 C9.- | 16.51,15.88 U$1.P$56 U$1.P$57 U$1.P$58 U$1.P$59 U$1.P$60 U$1.P$61 U$1.P$62 U$1.P$63 U$1.P$64 U$1.P$65 U$1.P$66 U$1.P$67 U$1.P$68 U$1.P$69 U$1.P$70 U$1.P$71 U$1.P$72 U$1.P$73 U$1.P$74 U$1.P$75 U$1.P$76 U$1.P$77 U$1.P$78 U$1.P$79 U$1.P$80 U$1.P$81 U$1.P$82 U$1.P$83 U$1.P$84 U$1.P$85 U$1.P$86 U$1.P$87 U$1.P$88 U$1.P$89 U$1.P$90 U$1.P$91 U$1.P$92 U$1.P$93 U$1.P$94 66.04,15.88 | 67.94,6.98 v67.94,5.71 v70.48,5.71 70.48,6.98
  pour Bottom (isolate 0.406): 0.64,57.78 83.19,57.78 83.19,0.64 0.64,0.64
  pour Top (isolate 0.406): 0.64,57.78 0.64,0.64 83.19,0.64 83.19,57.78
MA1
  Top 0.305: CON1.A17 43.18,45.85 39.75,42.42 IC2.13
MA2
  Top 0.305: CON1.A15 38.1,43.08 37.75,42.73 IC2.17
MA3
  Top 0.305: CON1.A13 33.02,45.35 36.25,42.12 IC2.20
MA4
  Top 0.305: IC1.2 25.5,40.41 27.94,42.85 CON1.A11
MA5
  Top 0.305: IC1.8 22.5,40.41 22.86,40.77 CON1.A9
MA6
  Top 0.305: IC1.13 20,40.66 17.78,42.88 CON1.A7
MA7
  Top 0.305: IC1.19 17,40.66 12.7,44.96 CON1.A5
MA8
  Top 0.305: IC1.23 15,40.41 7.62,47.79 CON1.A3
MA9  (via drill 0.5 pad 1.5)
  Top 0.305: IC1.20 16.5,40.41 11.43,45.48 v11.43,47.62
  Bottom 0.305: CON1.B4 10.16,48.89 v11.43,47.62
MA10  (via drill 0.5 pad 1.5)
  Top 0.305: 13.97,46.99 v13.97,47.62 13.97,44.44 18,40.41 IC1.17
  Bottom 0.305: CON1.B5 12.7,48.89 v13.97,47.62
MA11
  Top 0.305: IC1.22 15.5,40.66 10.3,45.86 | 10.3,45.86 10.19,45.97 | CON1.A4 10.16,46 10.3,45.86
MA12
  Top 0.305: IC1.16 18.5,40.66 15.24,43.92 CON1.A6
MA13
  Top 0.305: IC1.11 21,41.16 20.32,41.84 CON1.A8
MA14
  Top 0.305: IC1.5 24,40.41 25.4,41.81 CON1.A10
MA15
  Top 0.305: CON1.A12 30.48,47.12 35.25,42.36 IC2.22
MA16
  Top 0.305: CON1.A14 35.56,43.58 36.75,42.39 IC2.19
MA17
  Top 0.305: CON1.A16 40.64,44.85 38.25,42.47 IC2.16
MA18  (via drill 0.5 pad 1.5)
  Top 0.305: 16.51,46.99 v16.51,47.62 16.51,43.4 19.5,40.41 IC1.14
  Bottom 0.305: CON1.B6 15.24,48.89 v16.51,47.62
MA19  (via drill 0.5 pad 1.5)
  Top 0.305: IC1.12 20.5,40.91 19.05,42.36 v19.05,47.62
  Bottom 0.305: CON1.B7 17.78,48.89 v19.05,47.62
MA20  (via drill 0.5 pad 1.5)
  Top 0.305: IC1.9 22,40.41 21.59,40.82 v21.59,47.62
  Bottom 0.305: CON1.B8 20.32,48.89 v21.59,47.62
MA21  (via drill 0.5 pad 1.5)
  Top 0.305: IC1.6 23.5,40.66 24.13,41.29 v24.13,47.62
  Bottom 0.305: CON1.B9 22.86,48.89 v24.13,47.62
MA22  (via drill 0.5 pad 1.5)
  Top 0.305: IC1.3 25,40.66 26.67,42.33 v26.67,47.62
  Bottom 0.305: CON1.B10 25.4,48.89 v26.67,47.62
MA23  (via drill 0.5 pad 1.5)
  Top 0.305: IC2.23 34.75,42.08 v29.21,47.62
  Bottom 0.305: v29.21,47.62 27.94,48.89 CON1.B11
MCLK  (via drill 0.5 pad 1.5)
  Top 0.305: v45.75,46.41 47.75,44.41 47.75,43.41 47,42.66 43,42.66 42.25,41.91 IC2.8
  Bottom 0.305: v45.75,46.41 48.26,48.89 CON1.B19
MD0
  Top 0.305: CON1.A20 50.8,47.76 57.25,41.31 IC3.22
MD1
  Top 0.305: CON1.A23 58.42,43.22 60.25,41.39 IC3.16
MD2
  Top 0.305: CON1.A26 66.04,42.45 64.25,40.66 IC3.8
MD3
  Top 0.305: CON1.A29 73.66,47.76 66.75,40.85 IC3.3
MD4
  Top 0.305: CON1.A28 71.12,45.99 65.75,40.62 IC3.5
MD5
  Top 0.305: CON1.A25 63.5,41.47 62.75,40.72 IC3.11
MD6
  Top 0.305: CON1.A22 55.88,44.22 58.75,41.35 IC3.19
MD7
  Top 0.305: CON1.A19 48.26,49.53 56.75,41.04 IC3.23
MD8
  Top 0.305: CON1.A21 53.34,45.99 58.25,41.08 IC3.20
MD9
  Top 0.305: CON1.A24 60.96,42.22 61.75,41.43 IC3.13
MD10
  Top 0.305: CON1.A27 68.58,44.22 65.25,40.89 IC3.6
MD11
  Top 0.305: CON1.A30 76.2,49.53 67.25,40.58 IC3.2
MD12  (via drill 0.5 pad 1.5)
  Top 0.305: v64.77,47.62 64.77,41.95 63.75,40.93 IC3.9
  Bottom 0.305: CON1.B25 63.5,48.89 v64.77,47.62
MD13  (via drill 0.5 pad 1.5)
  Top 0.305: v62.23,47.62 62.23,45.72 62.25,45.7 IC3.12
  Bottom 0.305: CON1.B24 60.96,48.89 v62.23,47.62
MD14  (via drill 0.5 pad 1.5)
  Top 0.305: v59.69,47.62 59.69,42.72 61.25,41.16 IC3.14
  Bottom 0.305: CON1.B23 58.42,48.89 v59.69,47.62
MD15  (via drill 0.5 pad 1.5)
  Top 0.305: v57.15,47.62 57.15,43.72 59.75,41.12 IC3.17
  Bottom 0.305: CON1.B22 55.88,48.89 v57.15,47.62
N$1
  Top 0.305: IC2.6 IC2.5 43.75,40.41 44.5,41.16 R3.1 45.25,41.11 IC2.2 IC2.3
N$2
  Bottom 0.305: Q1.3 8.75,26.41 8,27.16 8,28.16 8.75,28.91 8.75,35.16 5.08,38.83 CON1.B2
N$3
  Top 0.254: 0.13,58.29 0.13,0.13 83.69,0.13 83.69,58.29
N$4
  Bottom 0.305: R4.1 7.7,25.41 Q1.1
R/!W  (via drill 0.5 pad 1.5)
  Top 0.305: IC3.24 55.73,39.44 55,40.16 v55,40.66 | v69,40.66 69,40.16 68.25,39.41 67.78,39.41 IC3.1
  Bottom 0.305: v55,40.66 v69,40.66 71,40.66 75.25,36.41 75.25,29.41 76.25,28.41 76.25,22.16 78.74,19.68 78.74,5.71 77.47,4.45 66.67,4.45 | 66.67,4.45 U$1.P$45 | v65.41,3.18 66.67,4.45
(copper drawn outside any net)
  shapes: Top circle x4

### Text on the board
Bottom: (C)2010 Chris McClelland | UMDKv2 Prototype